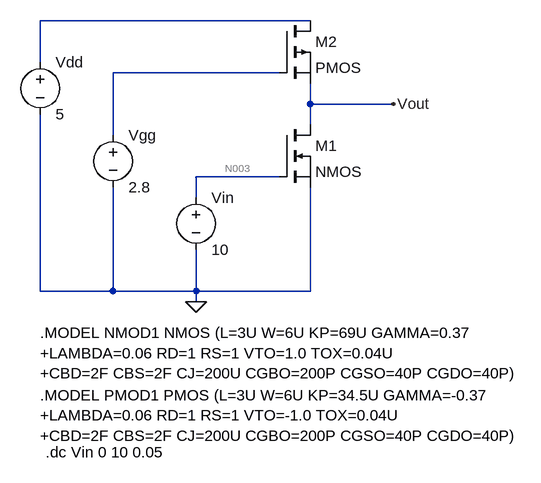
[diagram p0: schematic ee347_prelab2_1c.asc]
ee347_prelab2_1c.asc, the LTspice schematic file:
Version 4
SHEET 1 880 680
WIRE 160 -448 -256 -448
WIRE -256 -384 -256 -448
WIRE 112 -368 -144 -368
WIRE 160 -320 160 -352
WIRE 288 -320 160 -320
WIRE 160 -288 160 -320
WIRE -144 -272 -144 -368
WIRE 112 -208 -16 -208
WIRE -16 -176 -16 -208
WIRE -256 -32 -256 -304
WIRE -144 -32 -144 -192
WIRE -144 -32 -256 -32
WIRE -16 -32 -16 -96
WIRE -16 -32 -144 -32
WIRE 160 -32 160 -192
WIRE 160 -32 -16 -32
WIRE -16 -16 -16 -32
FLAG -16 -16 0
FLAG 288 -320 Vout
SYMBOL voltage -16 -192 R0
SYMATTR InstName Vin
SYMATTR Value 10
SYMBOL voltage -144 -288 R0
SYMATTR InstName Vgg
SYMATTR Value 2.8
SYMBOL nmos 112 -288 R0
SYMATTR InstName M1
SYMBOL pmos 112 -448 R0
SYMATTR InstName M2
SYMBOL voltage -256 -400 R0
SYMATTR InstName Vdd
SYMATTR Value 5
TEXT -256 32 Left 2 !.MODEL NMOD1 NMOS (L=3U W=6U KP=69U GAMMA=0.37\n+LAMBDA=0.06 RD=1 RS=1 VTO=1.0 TOX=0.04U\n+CBD=2F CBS=2F CJ=200U CGBO=200P CGSO=40P CGDO=40P)
TEXT -248 216 Left 2 !.dc Vin 0 10 0.05
TEXT -256 128 Left 2 !.MODEL PMOD1 PMOS (L=3U W=6U KP=34.5U GAMMA=-0.37\n+LAMBDA=0.06 RD=1 RS=1 VTO=-1.0 TOX=0.04U\n+CBD=2F CBS=2F CJ=200U CGBO=200P CGSO=40P CGDO=40P)

The netlist it stands for:
* ee347_prelab2_1c.asc
Vin N003 0 10
Vgg N002 0 2.8
M1 Vout N003 0 0 NMOS
M2 N001 N002 Vout Vout PMOS
Vdd N001 0 5
.model NMOS NMOS
.model PMOS PMOS
.lib standard.mos
.MODEL NMOD1 NMOS (L=3U W=6U KP=69U GAMMA=0.37
+LAMBDA=0.06 RD=1 RS=1 VTO=1.0 TOX=0.04U
+CBD=2F CBS=2F CJ=200U CGBO=200P CGSO=40P CGDO=40P)
.dc Vin 0 10 0.05
.MODEL PMOD1 PMOS (L=3U W=6U KP=34.5U GAMMA=-0.37
+LAMBDA=0.06 RD=1 RS=1 VTO=-1.0 TOX=0.04U
+CBD=2F CBS=2F CJ=200U CGBO=200P CGSO=40P CGDO=40P)
.backanno
.end

* Results of the author's LTspice run, read from the files saved beside the schematic
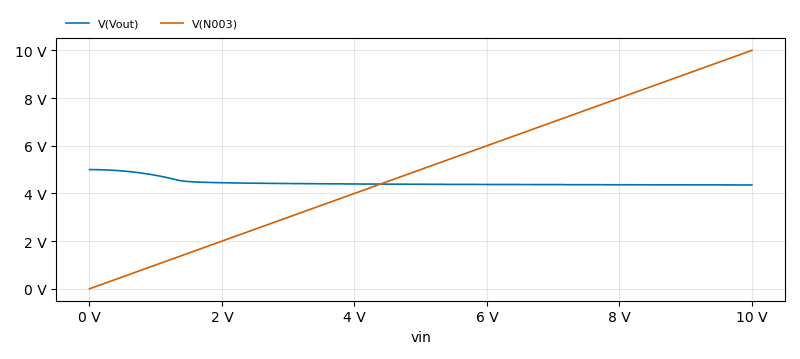
[diagram p1: DC transfer characteristic of ee347_prelab2_1c.asc, plotted from the saved traces]
* DC transfer characteristic, 1 run:
*   V(Vout): 5 V at vin=0 V, 4.356 V at vin=10 V, min 4.356 V, max 5 V
*   V(N003): 0 V at vin=0 V, 10 V at vin=10 V, min 0 V, max 10 V